# EAGLE design connect4V1 (EAGLE 9.7.0)
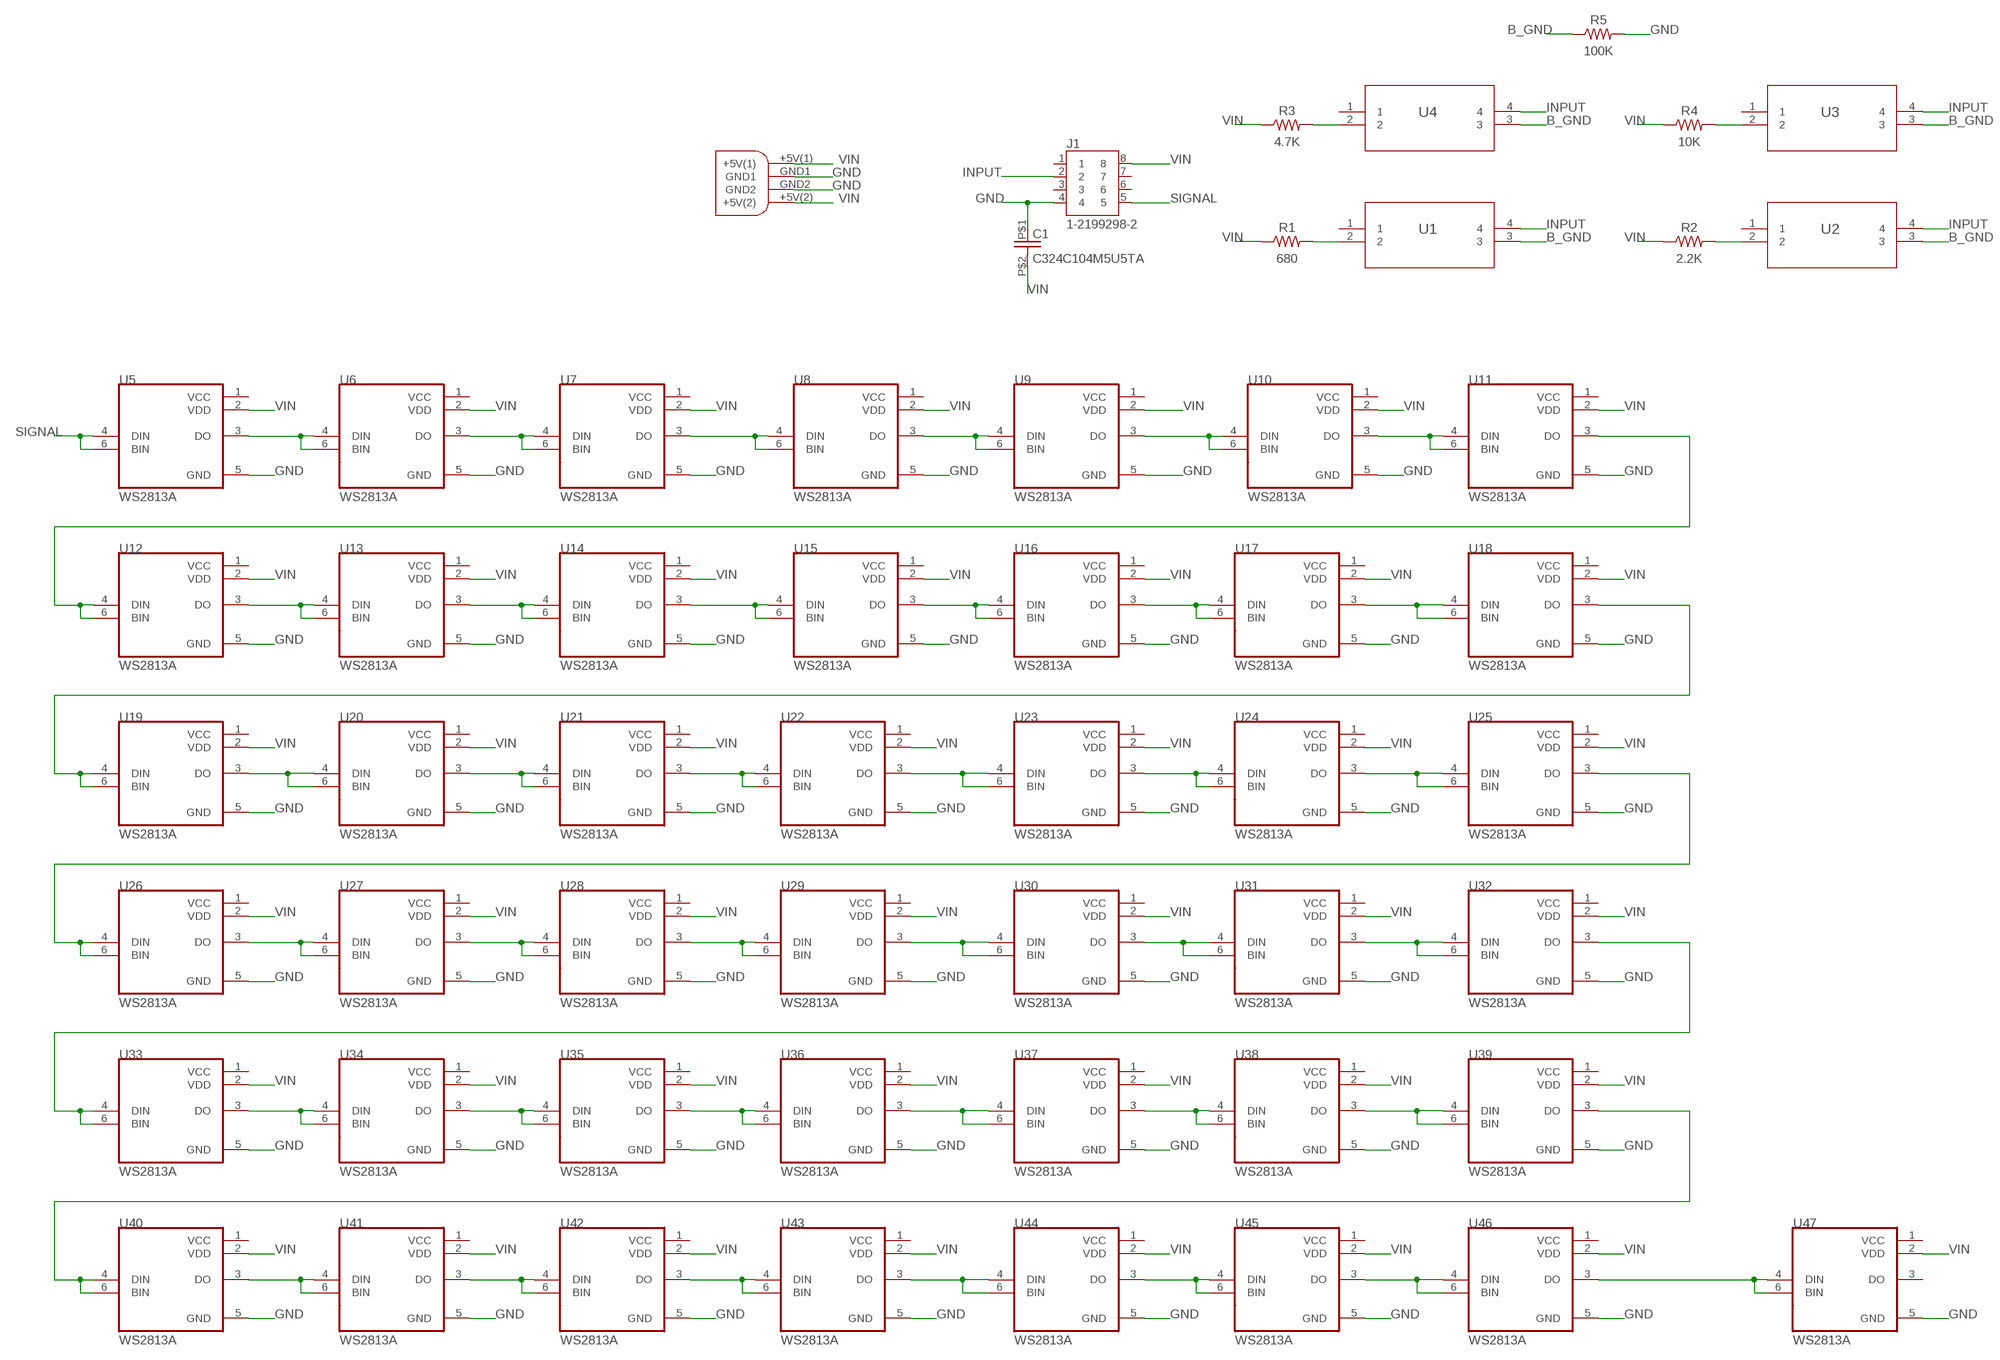
[diagram p0: schematic, sheet 1]

## Parts
C1  C324C104M5U5TA  [CAPRR254W55L508T318H508P]
J1  1-2199298-2  [TE_1-2199298-2]
R1  680  R-US_AXIAL-7.2MM-PITCH  [RESAD724W46L381D178B]
R2  2.2K  R-US_AXIAL-7.2MM-PITCH  [RESAD724W46L381D178B]
R3  4.7K  R-US_AXIAL-7.2MM-PITCH  [RESAD724W46L381D178B]
R4  10K  R-US_AXIAL-7.2MM-PITCH  [RESAD724W46L381D178B]
R5  100K  R-US_AXIAL-7.2MM-PITCH  [RESAD724W46L381D178B]
U1  PTS526_SK15_SMTR2_LFSSMT_FS-M  [SMT_FS-M]
U2  PTS526_SK15_SMTR2_LFSSMT_FS-M  [SMT_FS-M]
U3  PTS526_SK15_SMTR2_LFSSMT_FS-M  [SMT_FS-M]
U4  PTS526_SK15_SMTR2_LFSSMT_FS-M  [SMT_FS-M]
U5  WS2813A  [LED_WS2813A]
U6  WS2813A  [LED_WS2813A]
U7  WS2813A  [LED_WS2813A]
U8  WS2813A  [LED_WS2813A]
U9  WS2813A  [LED_WS2813A]
U10  WS2813A  [LED_WS2813A]
U11  WS2813A  [LED_WS2813A]
U12  WS2813A  [LED_WS2813A]
U13  WS2813A  [LED_WS2813A]
U14  WS2813A  [LED_WS2813A]
U15  WS2813A  [LED_WS2813A]
U16  WS2813A  [LED_WS2813A]
U17  WS2813A  [LED_WS2813A]
U18  WS2813A  [LED_WS2813A]
U19  WS2813A  [LED_WS2813A]
U20  WS2813A  [LED_WS2813A]
U21  WS2813A  [LED_WS2813A]
U22  WS2813A  [LED_WS2813A]
U23  WS2813A  [LED_WS2813A]
U24  WS2813A  [LED_WS2813A]
U25  WS2813A  [LED_WS2813A]
U26  WS2813A  [LED_WS2813A]
U27  WS2813A  [LED_WS2813A]
U28  WS2813A  [LED_WS2813A]
U29  WS2813A  [LED_WS2813A]
U30  WS2813A  [LED_WS2813A]
U31  WS2813A  [LED_WS2813A]
U32  WS2813A  [LED_WS2813A]
U33  WS2813A  [LED_WS2813A]
U34  WS2813A  [LED_WS2813A]
U35  WS2813A  [LED_WS2813A]
U36  WS2813A  [LED_WS2813A]
U37  WS2813A  [LED_WS2813A]
U38  WS2813A  [LED_WS2813A]
U39  WS2813A  [LED_WS2813A]
U40  WS2813A  [LED_WS2813A]
U41  WS2813A  [LED_WS2813A]
U42  WS2813A  [LED_WS2813A]
U43  WS2813A  [LED_WS2813A]
U44  WS2813A  [LED_WS2813A]
U45  WS2813A  [LED_WS2813A]
U46  WS2813A  [LED_WS2813A]
U47  WS2813A  [LED_WS2813A]
U$1  4PIN_POWER  [4PIN_POWER]

## Nets
B_GND: R5.1 U1.3 U2.3 U3.3 U4.3
GND: C1.P$1 J1.4 R5.2 U5.5(GND) U6.5(GND) U7.5(GND) U8.5(GND) U9.5(GND) U10.5(GND) U11.5(GND) U12.5(GND) U13.5(GND) U14.5(GND) U15.5(GND) U16.5(GND) U17.5(GND) U18.5(GND) U19.5(GND) U20.5(GND) U21.5(GND) U22.5(GND) U23.5(GND) U24.5(GND) U25.5(GND) U26.5(GND) U27.5(GND) U28.5(GND) U29.5(GND) U30.5(GND) U31.5(GND) U32.5(GND) U33.5(GND) U34.5(GND) U35.5(GND) U36.5(GND) U37.5(GND) U38.5(GND) U39.5(GND) U40.5(GND) U41.5(GND) U42.5(GND) U43.5(GND) U44.5(GND) U45.5(GND) U46.5(GND) U47.5(GND) U$1.GND1 U$1.GND2
INPUT: J1.2 U1.4 U2.4 U3.4 U4.4
N$1: U6.3(DO) U7.4(DIN) U7.6(BIN)
N$2: U5.3(DO) U6.4(DIN) U6.6(BIN)
N$3: U7.3(DO) U8.4(DIN) U8.6(BIN)
N$4: U8.3(DO) U9.4(DIN) U9.6(BIN)
N$5: U10.3(DO) U11.4(DIN) U11.6(BIN)
N$6: U13.3(DO) U14.4(DIN) U14.6(BIN)
N$7: U30.3(DO) U31.4(DIN) U31.6(BIN)
N$8: U12.3(DO) U13.4(DIN) U13.6(BIN)
N$9: U14.3(DO) U15.4(DIN) U15.6(BIN)
N$10: U15.3(DO) U16.4(DIN) U16.6(BIN)
N$11: U16.3(DO) U17.4(DIN) U17.6(BIN)
N$12: U17.3(DO) U18.4(DIN) U18.6(BIN)
N$13: U19.3(DO) U20.4(DIN) U20.6(BIN)
N$14: U20.3(DO) U21.4(DIN) U21.6(BIN)
N$15: U21.3(DO) U22.4(DIN) U22.6(BIN)
N$16: U22.3(DO) U23.4(DIN) U23.6(BIN)
N$17: U23.3(DO) U24.4(DIN) U24.6(BIN)
N$18: U24.3(DO) U25.4(DIN) U25.6(BIN)
N$19: U18.3(DO) U19.4(DIN) U19.6(BIN)
N$20: U26.3(DO) U27.4(DIN) U27.6(BIN)
N$21: U27.3(DO) U28.4(DIN) U28.6(BIN)
N$22: U28.3(DO) U29.4(DIN) U29.6(BIN)
N$23: U29.3(DO) U30.4(DIN) U30.6(BIN)
N$24: U4.1
N$25: U31.3(DO) U32.4(DIN) U32.6(BIN)
N$26: U25.3(DO) U26.4(DIN) U26.6(BIN)
N$27: U33.3(DO) U34.4(DIN) U34.6(BIN)
N$28: U34.3(DO) U35.4(DIN) U35.6(BIN)
N$29: U35.3(DO) U36.4(DIN) U36.6(BIN)
N$30: U36.3(DO) U37.4(DIN) U37.6(BIN)
N$31: U37.3(DO) U38.4(DIN) U38.6(BIN)
N$32: U38.3(DO) U39.4(DIN) U39.6(BIN)
N$33: U32.3(DO) U33.4(DIN) U33.6(BIN)
N$34: U40.3(DO) U41.4(DIN) U41.6(BIN)
N$35: U41.3(DO) U42.4(DIN) U42.6(BIN)
N$36: U42.3(DO) U43.4(DIN) U43.6(BIN)
N$37: U11.3(DO) U12.4(DIN) U12.6(BIN)
N$38: U43.3(DO) U44.4(DIN) U44.6(BIN)
N$39: U44.3(DO) U45.4(DIN) U45.6(BIN)
N$40: U45.3(DO) U46.4(DIN) U46.6(BIN)
N$41: U39.3(DO) U40.4(DIN) U40.6(BIN)
N$42: U46.3(DO) U47.4(DIN) U47.6(BIN)
N$43: R1.2 U1.2
N$44: R3.2 U4.2
N$45: R2.2 U2.2
N$46: R4.2 U3.2
N$47: U9.3(DO) U10.4(DIN) U10.6(BIN)
SIGNAL: J1.5 U5.4(DIN) U5.6(BIN)
VIN: C1.P$2 J1.8 R1.1 R2.1 R3.1 R4.1 U5.2(VDD) U6.2(VDD) U7.2(VDD) U8.2(VDD) U9.2(VDD) U10.2(VDD) U11.2(VDD) U12.2(VDD) U13.2(VDD) U14.2(VDD) U15.2(VDD) U16.2(VDD) U17.2(VDD) U18.2(VDD) U19.2(VDD) U20.2(VDD) U21.2(VDD) U22.2(VDD) U23.2(VDD) U24.2(VDD) U25.2(VDD) U26.2(VDD) U27.2(VDD) U28.2(VDD) U29.2(VDD) U30.2(VDD) U31.2(VDD) U32.2(VDD) U33.2(VDD) U34.2(VDD) U35.2(VDD) U36.2(VDD) U37.2(VDD) U38.2(VDD) U39.2(VDD) U40.2(VDD) U41.2(VDD) U42.2(VDD) U43.2(VDD) U44.2(VDD) U45.2(VDD) U46.2(VDD) U47.2(VDD) U$1.+5V(1) U$1.+5V(2)
Unconnected: J1.1 J1.3 J1.6 J1.7 U1.1 U2.1 U3.1 U47.3(DO)

## Power pins joined to a net without a drawn wire
VIN: U5.1(VCC) U6.1(VCC) U7.1(VCC) U8.1(VCC) U9.1(VCC) U10.1(VCC) U11.1(VCC) U12.1(VCC) U13.1(VCC) U14.1(VCC) U15.1(VCC) U16.1(VCC) U17.1(VCC) U18.1(VCC) U19.1(VCC) U20.1(VCC) U21.1(VCC) U22.1(VCC) U23.1(VCC) U24.1(VCC) U25.1(VCC) U26.1(VCC) U27.1(VCC) U28.1(VCC) U29.1(VCC) U30.1(VCC) U31.1(VCC) U32.1(VCC) U33.1(VCC) U34.1(VCC) U35.1(VCC) U36.1(VCC) U37.1(VCC) U38.1(VCC) U39.1(VCC) U40.1(VCC) U41.1(VCC) U42.1(VCC) U43.1(VCC) U44.1(VCC) U45.1(VCC) U46.1(VCC) U47.1(VCC)

## Library data of the parts
C1 = ceramicCap:C324C104M5U5TA: Cap Ceramic 0.1uF 50V Z5U 20% Radial 2.54mm 85C Bulk; MANUFACTURER: Kemet
J1 = 8PinDip:1-2199298-2: CONN IC DIP SOCKET 8POS TIN; COMMENT: 1-2199298-2
R1-R5 = Resistor:R-US: Resistor Fixed - ANSI; CATEGORY: Resistor; SUB-CATEGORY: Fixed
U1-U4 = SMD_Button:PTS526_SK15_SMTR2_LFS; BUILT_BY: EMA_Matt; COPYRIGHT: Copyright (C) 2018 Accelerated Designs. All rights reserved; MANUFACTURER_PART_NUMBER: PTS526 SK15 SMTR2 LFS; SOURCELIBRARY: C&K_2019-11-15; VENDOR: C&K
U5-U47 = WS2813A:WS2813A: Intelligent control LED integrated light source; MANUFACTURER: Worldsemi; STANDARD: Manufacturer Recommendations
U$1 = 4Pin_power_connector:4PIN_POWER

## Board
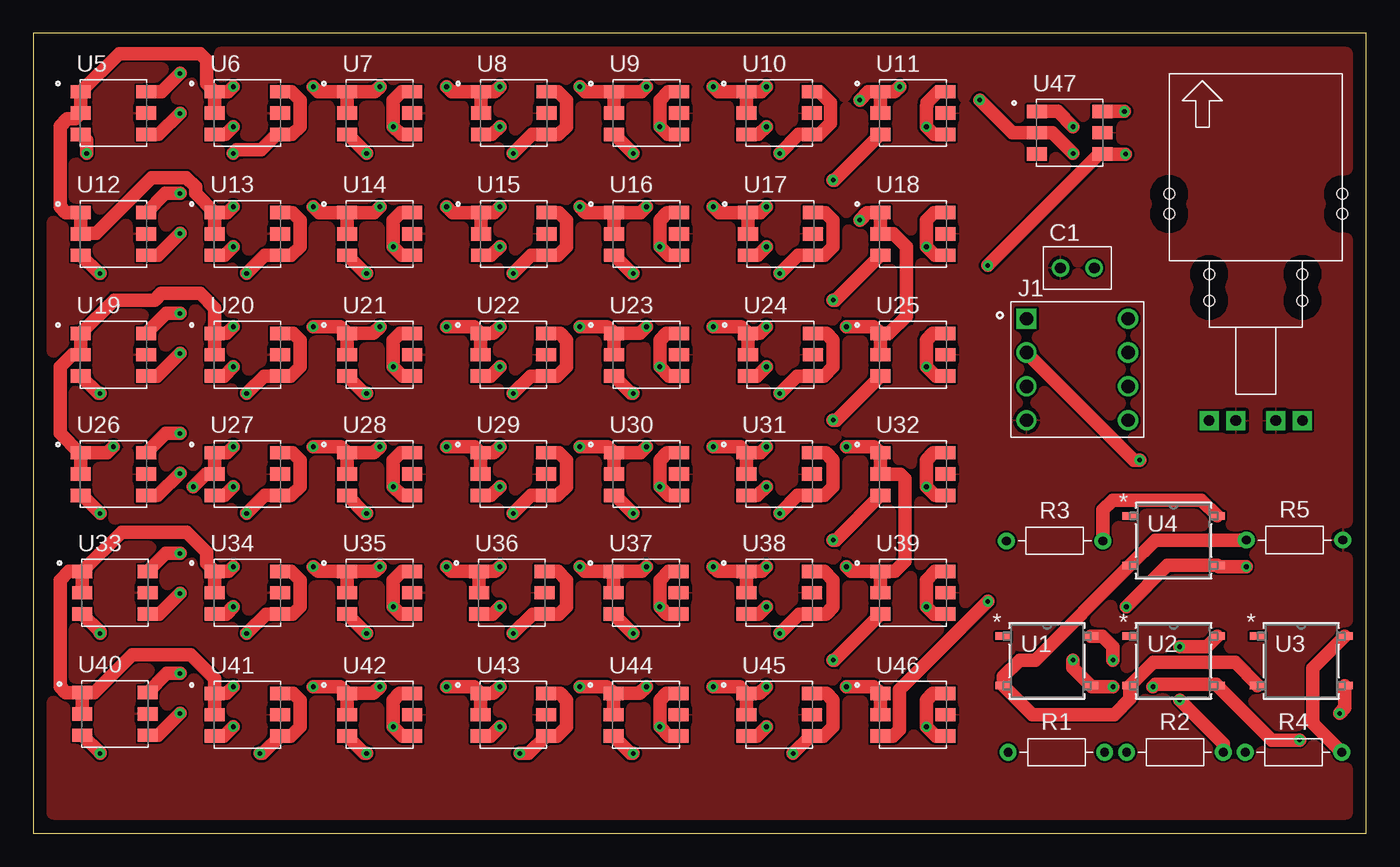
[diagram p1: board, top side]
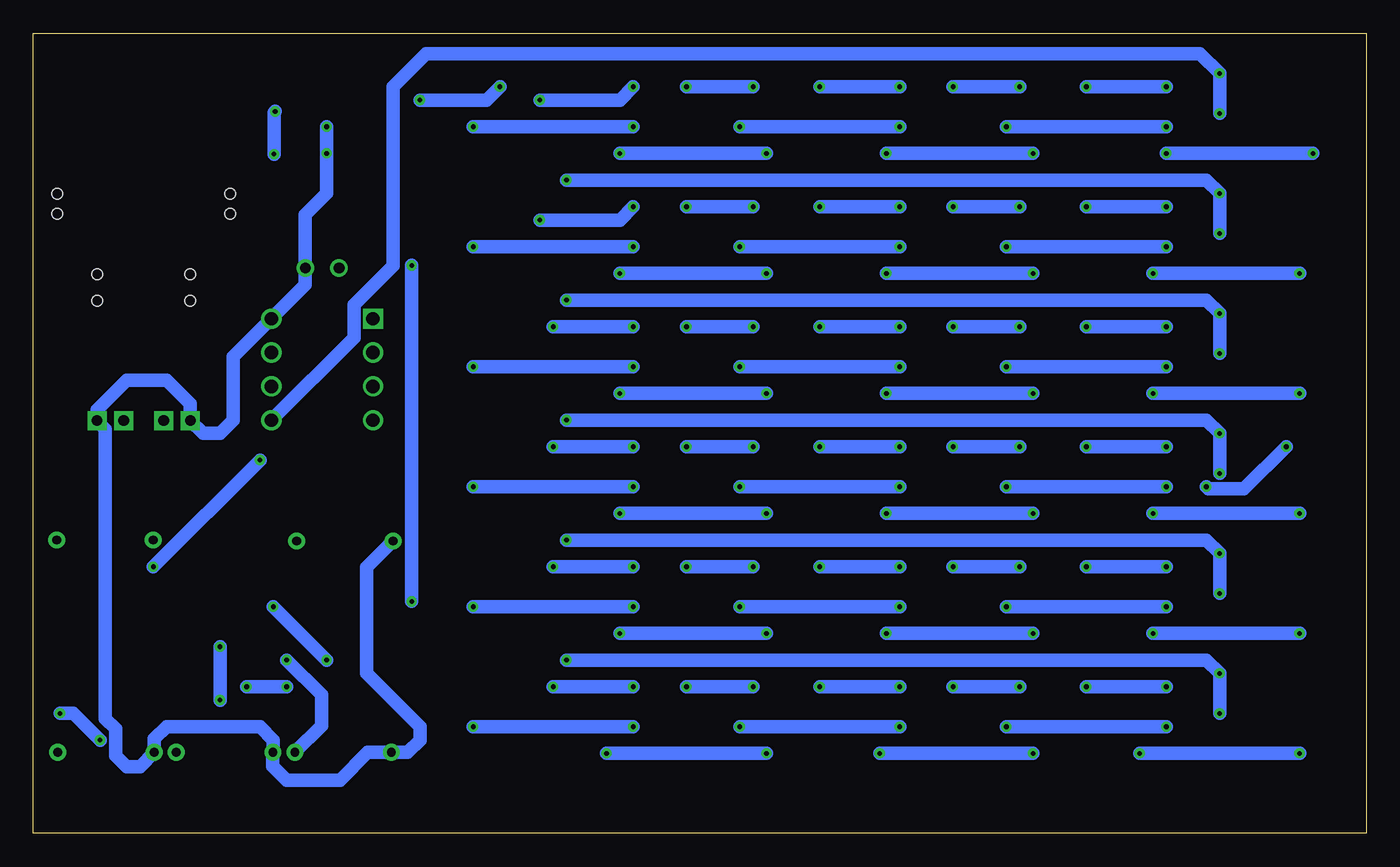
[diagram p2: board, bottom side, seen from below]

Size 100 x 60 mm. Coordinates in mm from the lower left corner, seen from the top.
Outline: 0,0 100,0 100,60 0,60 0,0
Copper layers (1*16): Top 0.035mm / dielectric 1.5mm / Bottom 0.035mm
Design rules "default": minimum track width 6mil, minimum drill 0.35mm, track to track 6mil, track to pad 6mil, pad to pad 6mil, via to via 6mil, smd to smd 6mil, copper to edge 40mil, drill to drill 6mil, minimum pad ring 10mil, minimum via ring 8mil, stop-mask expansion 4mil, vias tented up to drill 0mil, thermal gap 10mil

### Footprints (pad centres in the part's own frame; a part is rotated, then mirrored left to right if it is on the bottom)
CAPRR254W55L508T318H508P = drill 0.8: P$1 -1.27,0; P$2 1.27,0
TE_1-2199298-2 = drill 1 square: 1 -3.81,3.81 | drill 1: 2 -3.81,1.27; 3 -3.81,-1.27; 4 -3.81,-3.81; 5 3.81,-3.81; 6 3.81,-1.27; 7 3.81,1.27; 8 3.81,3.81
RESAD724W46L381D178B = drill 0.66 pad 1.26: 1 -3.62,0; 2 3.62,0
SMT_FS-M = smd 1.156 x 0.559: 1 -3.283,1.854; 2 3.283,1.854; 3 -3.283,-1.854; 4 3.283,-1.854
LED_WS2813A = smd 1.5 x 1: 1 -2.45,1.6; 2 -2.45,0; 3 -2.45,-1.6; 4 2.45,-1.6; 5 2.45,0; 6 2.45,1.6
4PIN_POWER = drill 0.8 pad 1.422 square: +5V(1) 3,-12; +5V(2) 10,-12; GND1 5,-12; GND2 8,-12 | hole 0.8: 13,5; 0,5; 10,-1; 10,-3; 3,-3; 3,-1; 13,3.5; 0,3.5

### Placement (x,y rotation side)
C1  78.33,42.41 0 top
J1  78.33,34.79 0 top
R1  76.76,6.08 0 top
R2  85.65,6.08 0 top
R3  76.63,21.93 0 top
R4  94.54,6.08 0 top
R5  94.63,22 0 top
U1  76.06,12.93 0 top
U2  85.55,12.93 0 top
U3  95.12,12.93 0 top
U4  85.55,21.95 0 top
U5  6.02,54.02 0 top
U6  16.05,54.02 0 top
U7  25.98,54.02 0 top
U8  36.04,54.02 0 top
U9  46,54.02 0 top
U10  55.96,54.02 0 top
U11  65.99,54.02 0 top
U12  6.02,44.96 0 top
U13  16.05,44.96 0 top
U14  25.98,44.96 0 top
U15  36.04,44.96 0 top
U16  46,44.96 0 top
U17  56.06,44.96 0 top
U18  65.99,44.96 0 top
U19  6.02,35.9 0 top
U20  16.05,35.9 0 top
U21  25.98,35.9 0 top
U22  36.01,35.9 0 top
U23  46,35.9 0 top
U24  56.06,35.9 0 top
U25  65.99,35.9 0 top
U26  6.02,26.94 0 top
U27  16.05,26.94 0 top
U28  25.98,26.94 0 top
U29  36.01,26.94 0 top
U30  46,26.94 0 top
U31  55.96,26.94 0 top
U32  65.99,26.94 0 top
U33  6.12,18.05 0 top
U34  16.05,18.05 0 top
U35  25.98,18.05 0 top
U36  35.91,18.05 0 top
U37  45.97,18.05 0 top
U38  55.96,18.05 0 top
U39  65.99,18.05 0 top
U40  6.12,8.96 0 top
U41  16.05,8.89 0 top
U42  25.98,8.89 0 top
U43  36.01,8.89 0 top
U44  45.97,8.89 0 top
U45  55.96,8.89 0 top
U46  65.99,8.89 0 top
U47  77.76,52.54 0 top
U$1  85.22,42.95 0 top

### Tracks (layer width: path | path; a pad name or v marks a point on that pad's centre or on a via)
B_GND
  Top 1.016: R5.1 84.17,22 U4.3 75.17,13 74,13 72.78,11.78 U1.3 74.94,8.91 81.1,8.91 82.27,10.08 U2.3 84.02,12.83 90.17,12.83 91.84,11.16 U3.3
GND
  pour Top: -2,65 102,65 105,62 105,-2 101,-6 -1,-6 -4,-3 -4,63
INPUT  (via drill 0.35)
  Top 1.016: J1.2 82.58,28 v83,28 | v78,13 78,12.42 U1.4 79.42,11 v81,11 | v95,7 92.91,7 U2.4 88.74,11.17 84.17,11.17 v84,11 | v98,9 98.41,9.41 U3.4 | v91,20 88.93,20 U4.4 85.1,20.1 v82,17
  Bottom 1.016: v81,11 v84,11 | v98,9 97,9 v95,7 | v83,28 v91,20 | v82,17 v78,13
N$1  (via drill 0.35)
  Top 1.016: U6.3 14.42,52.42 v15,53 | U7.4 27.58,52.42 v27,53 27,55 27.62,55.62 U7.6
  Bottom 1.016: v15,53 v27,53
N$2  (via drill 0.35)
  Top 1.016: U6.6 19.38,55.62 20,55 20,53 19.42,52.42 U6.4 18.25,52.42 17.08,51.25 15.25,51.25 v15,51 | U5.3 4,51.99 v4,51
  Bottom 1.016: v4,51 v15,51
N$3  (via drill 0.35)
  Top 1.016: U8.6 39.38,55.62 40,55 40,53 39.42,52.42 U8.4 37.42,52.42 v36,51 | U7.3 23.58,52.42 v25,51
  Bottom 1.016: v25,51 v36,51
N$4  (via drill 0.35)
  Top 1.016: U8.3 34.42,52.42 v35,53 | U9.4 47.58,52.42 v47,53 47,55 47.62,55.62 U9.6
  Bottom 1.016: v35,53 v47,53
N$5  (via drill 0.35)
  Top 1.016: U10.3 54.42,52.42 v55,53 | U11.4 67.58,52.42 v67,53 67,54.53 67.03,54.56 67.03,54.79 67.86,55.62 U11.6
  Bottom 1.016: v55,53 v67,53
N$6  (via drill 0.35)
  Top 1.016: U13.3 14.36,43.36 v15,44 | U14.6 27.56,46.56 27,46 v27,44 27.64,43.36 U14.4
  Bottom 1.016: v15,44 v27,44
N$7  (via drill 0.35)
  Top 1.016: U31.6 59.46,28.54 60,28 60,26 59.34,25.34 U31.4 57.34,25.34 v56,24 | U30.3 43.66,25.34 v45,24
  Bottom 1.016: v45,24 v56,24
N$8  (via drill 0.35)
  Top 1.016: U13.6 19.44,46.56 20,46 20,44 19.36,43.36 U13.4 17.36,43.36 v16,42 | v5,42 4.93,42 U12.3
  Bottom 1.016: v5,42 v16,42
N$9  (via drill 0.35)
  Top 1.016: U15.6 39.44,46.56 40,46 40,44 39.36,43.36 U15.4 37.36,43.36 v36,42 | U14.3 24.89,42 v25,42
  Bottom 1.016: v25,42 v36,42
N$10  (via drill 0.35)
  Top 1.016: U15.3 34.36,43.36 v35,44 | U16.6 47.56,46.56 47,46 v47,44 47.64,43.36 U16.4
  Bottom 1.016: v35,44 v47,44
N$11  (via drill 0.35)
  Top 1.016: U16.3 44.91,42 v45,42 | v56,42 57.36,43.36 U17.4 59.36,43.36 60,44 60,46 59.44,46.56 U17.6
  Bottom 1.016: v45,42 v56,42
N$12  (via drill 0.35)
  Top 1.016: U17.3 54.36,43.36 v55,44 | U18.6 67.56,46.56 67,46 v67,44 67.64,43.36 U18.4
  Bottom 1.016: v55,44 v67,44
N$13  (via drill 0.35)
  Top 1.016: U20.6 19.5,37.5 20,37 20,35 19.3,34.3 U20.4 17.3,34.3 v16,33 | U19.3 4.87,33 v5,33
  Bottom 1.016: v5,33 v16,33
N$14  (via drill 0.35)
  Top 1.016: U21.4 27.7,34.3 v27,35 27,37 27.5,37.5 U21.6 | U20.3 14.3,34.3 v15,35
  Bottom 1.016: v27,35 v15,35
N$15  (via drill 0.35)
  Top 1.016: U22.6 39.5,37.5 40,37 40,35 39.3,34.3 U22.4 37.3,34.3 v36,33 | U21.3 24.83,33 v25,33
  Bottom 1.016: v25,33 v36,33
N$16  (via drill 0.35)
  Top 1.016: U23.6 47.5,37.5 47,37 v47,35 47.7,34.3 U23.4 | U22.3 34.3,34.3 v35,35
  Bottom 1.016: v47,35 v35,35
N$17  (via drill 0.35)
  Top 1.016: U24.6 59.5,37.5 60,37 60,35 59.3,34.3 U24.4 57.3,34.3 v56,33 | U23.3 44.85,33 v45,33
  Bottom 1.016: v45,33 v56,33
N$18  (via drill 0.35)
  Top 1.016: U25.6 67.5,37.5 67,37 v67,35 67.7,34.3 U25.4 | U24.3 54.3,34.3 v55,35
  Bottom 1.016: v67,35 v55,35
N$19  (via drill 0.35)
  Top 1.016: U18.3 60.18,40 v60,40 | U19.6 9.97,39 v11,39 | U19.4 9.3,34.3 v11,36
  Bottom 1.016: v60,40 12,40 v11,39 v11,36
N$20  (via drill 0.35)
  Top 1.016: U27.6 19.46,28.54 20,28 20,26 19.34,25.34 U27.4 17.34,25.34 v16,24 | U26.3 3.66,25.34 v5,24
  Bottom 1.016: v5,24 v16,24
N$21  (via drill 0.35)
  Top 1.016: U27.3 14.34,25.34 v15,26 | U28.4 27.66,25.34 v27,26 27,28 27.54,28.54 U28.6
  Bottom 1.016: v15,26 v27,26
N$22  (via drill 0.35)
  Top 1.016: U29.6 39.46,28.54 40,28 40,26 39.34,25.34 U29.4 37.34,25.34 v36,24 | U28.3 24.87,24 v25,24
  Bottom 1.016: v25,24 v36,24
N$23  (via drill 0.35)
  Top 1.016: U30.4 47.66,25.34 v47,26 47,28 47.54,28.54 U30.6 | U29.3 34.34,25.34 v35,26
  Bottom 1.016: v35,26 v47,26
N$25  (via drill 0.35)
  Top 1.016: U32.6 67.54,28.54 67,28 v67,26 67.66,25.34 U32.4 | U31.3 54.34,25.34 v55,26
  Bottom 1.016: v55,26 v67,26
N$26  (via drill 0.35)
  Top 1.016: U25.3 60.24,31 v60,31 | U26.6 9.93,30 v11,30 | U26.4 9.34,25.34 v11,27
  Bottom 1.016: v60,31 12,31 v11,30 v11,27
N$27  (via drill 0.35)
  Top 1.016: U34.6 19.35,19.65 20,19 20,17 19.45,16.45 U34.4 17.45,16.45 v16,15 | U33.3 5,15.12 v5,15
  Bottom 1.016: v5,15 v16,15
N$28  (via drill 0.35)
  Top 1.016: U34.3 14.45,16.45 v15,17 | U35.4 27.55,16.45 v27,17 27,19 27.65,19.65 U35.6
  Bottom 1.016: v15,17 v27,17
N$29  (via drill 0.35)
  Top 1.016: U36.6 39.35,19.65 40,19 40,17 39.45,16.45 U36.4 37.45,16.45 v36,15 | U35.3 24.98,15 v25,15
  Bottom 1.016: v25,15 v36,15
N$30  (via drill 0.35)
  Top 1.016: U36.3 34.45,16.45 v35,17 | U37.4 47.55,16.45 v47,17 47,19 47.65,19.65 U37.6
  Bottom 1.016: v35,17 v47,17
N$31  (via drill 0.35)
  Top 1.016: U38.6 59.35,19.65 60,19 60,17 59.45,16.45 U38.4 57.45,16.45 v56,15 | U37.3 44.97,15 v45,15
  Bottom 1.016: v45,15 v56,15
N$32  (via drill 0.35)
  Top 1.016: U39.4 67.55,16.45 v67,17 67,19 67.65,19.65 U39.6 | U38.3 54.45,16.45 v55,17
  Bottom 1.016: v55,17 v67,17
N$33  (via drill 0.35)
  Top 1.016: U32.3 60.2,22 v60,22 | U33.6 9.92,21 v11,21 | U33.4 9.45,16.45 v11,18
  Bottom 1.016: v60,22 12,22 v11,21 v11,18
N$34  (via drill 0.35)
  Top 1.016: U41.6 19.51,10.49 20,10 20,8 19.29,7.29 U41.4 17.21,6 v17,6 | U40.3 5,6.03 v5,6
  Bottom 1.016: v5,6 v17,6
N$35  (via drill 0.35)
  Top 1.016: U42.4 27.71,7.29 v27,8 27,10 27.49,10.49 U42.6 | U41.3 14.29,7.29 v15,8
  Bottom 1.016: v27,8 v15,8
N$36  (via drill 0.35)
  Top 1.016: U43.6 39.51,10.49 40,10 40,8 39.29,7.29 U43.4 37.17,6 v36.5,6 | U42.3 24.82,6 v25,6
  Bottom 1.016: v25,6 v36.5,6
N$37  (via drill 0.35)
  Top 1.016: U11.3 60.12,49 v60,49 | U12.6 9.91,48 v11,48 | U12.4 9.36,43.36 v11,45
  Bottom 1.016: v60,49 12,49 v11,48 v11,45
N$38  (via drill 0.35)
  Top 1.016: U44.4 47.71,7.29 v47,8 47,10 47.49,10.49 U44.6 | U43.3 34.29,7.29 v35,8
  Bottom 1.016: v47,8 v35,8
N$39  (via drill 0.35)
  Top 1.016: U45.6 59.51,10.49 60,10 60,8 59.29,7.29 U45.4 58.29,7.29 v57,6 | U44.3 44.81,6 v45,6
  Bottom 1.016: v45,6 v57,6
N$40  (via drill 0.35)
  Top 1.016: U46.4 67.71,7.29 v67,8 67,10 67.49,10.49 U46.6 | U45.3 54.29,7.29 v55,8
  Bottom 1.016: v67,8 v55,8
N$41  (via drill 0.35)
  Top 1.016: U39.3 60.09,13 v60,13 | U40.6 10.01,12 v11,12 | U40.4 9.36,7.36 v11,9
  Bottom 1.016: v60,13 12,13 v11,12 v11,9
N$42  (via drill 0.35)
  Top 1.016: v71.61,42.59 79.96,50.94 U47.4 v81.94,50.94 | v71.61,17.39 64.99,10.77 64.99,7.77 64.51,7.29 U46.3 | U47.6 v81.86,54.14
  Bottom 1.016: v71.61,17.39 v71.61,42.59 | v81.86,54.14 81.94,54.06 v81.94,50.94
N$43  (via drill 0.35)
  Top 1.016: v81,13 81,14 80.22,14.78 U1.2
  Bottom 1.016: R1.2 78.38,8.08 78.38,10.38 v81,13
N$44
  Top 1.016: R3.2 80.25,24.25 81,25 87.64,25 U4.2
N$45  (via drill 0.35)
  Top 1.016: R2.2 89.27,6.73 v86,10 | U2.2 88.05,14 v86,14
  Bottom 1.016: v86,10 v86,14
N$46
  Top 1.016: U3.2 96,12.38 96,8.24 R4.2
N$47  (via drill 0.35)
  Top 1.016: U10.6 58.99,55.62 59.82,54.79 59.82,53.25 58.99,52.42 U10.4 57.42,52.42 v56,51 | U9.3 43.58,52.42 v45,51
  Bottom 1.016: v45,51 v56,51
SIGNAL  (via drill 0.35)
  Top 1.016: U5.4 9.42,52.42 v11,54 | v11,57 9.62,55.62 U5.6
  Bottom 1.016: J1.5 75.93,37.19 75.93,39.63 73,42.56 73,56 70.52,58.48 12.48,58.48 v11,57 v11,54
VIN  (via drill 0.35)
  Top 1.016: v78,51 76.46,52.54 U47.2 73.46,52.54 v71,55 | v78,53 76.86,54.14 U47.1 | v65,56 64.62,55.62 U11.1 | v55,56 54.62,55.62 U10.1 | U11.2 U11.1 | U11.1 62.62,55.62 v62,55 | U10.1 U10.2 | U9.1 U9.2 | U16.1 U16.2 | U17.1 U17.2 | U25.1 U25.2 | U24.1 U24.2 | U23.1 U23.2 | U22.1 U22.2 | U21.1 U21.2 | U20.1 U20.2 | U13.1 U13.2 | U26.1 U26.2 | U28.1 U28.2 | U35.1 U35.2 | U34.1 U34.2 | U33.1 U33.2 | U40.1 U40.2 | U41.1 U41.2 | U42.1 U42.2 | U43.1 U43.2 | U44.1 U44.2 | U45.1 U45.2 | U46.2 U46.1 63.03,11 v61,11 | U39.1 U39.2 | U31.1 U31.2 | U38.1 U38.2 | U37.1 U37.2 | U30.1 U30.2 | U29.1 U29.2 | U36.1 U36.2 | U6.1 U6.2 | U7.1 U7.2 | U14.1 U14.2 | U15.1 U15.2 | U8.1 U8.2 | U10.1 51.38,55.62 v51,56 | v46,56 45.62,55.62 U9.1 | U9.1 41.38,55.62 v41,56 | v35,56 34.62,55.62 U8.1 | U8.1 31.38,55.62 v31,56 | v26,56 25.62,55.62 U7.1 | U7.1 21.38,55.62 v21,56 | U6.1 13,56.22 13,58 12.52,58.48 6.43,58.48 U5.1 U5.2 3.14,53.59 2.55,53.59 2,53.03 2,47 2.44,46.56 U12.1 U12.2 3.61,45 4.73,45 8.89,49.17 11.48,49.17 12.17,48.48 12.17,47.99 U13.1 | v62,46 62.56,46.56 U18.1 U18.2 64.54,44.96 65.5,44 65.5,38.8 64.2,37.5 U25.1 | v55,47 54.56,46.56 U17.1 | U17.1 51.44,46.56 v51,47 | v46,47 45.56,46.56 U16.1 | U16.1 41.44,46.56 v41,47 | v35,47 34.56,46.56 U15.1 | U15.1 31.44,46.56 v31,47 | v26,47 25.56,46.56 U14.1 | U14.1 21.44,46.56 v21,47 | U20.1 13.6,39.4 12.5,40.5 9.6,40.5 9.1,40 6.07,40 U19.1 U19.2 2.9,35.9 2,35 2,30 3.46,28.54 U26.1 | U20.1 14.5,37.5 v15,38 | v21,38 23.03,38 U21.1 | U21.1 25.5,37.5 v26,38 | v31,38 33.06,38 U22.1 | v41,38 43.05,38 U23.1 | U23.1 45.5,37.5 v46,38 | v51,38 53.11,38 U24.1 | v61,38 63.04,38 U25.1 | U26.1 5.54,28.54 v6,29 | v12,26 12.94,26.94 U27.2 U27.1 14.54,28.54 v15,29 | v21,29 23.07,29 U28.1
  Top 1.016: U28.1 25.54,28.54 v26,29 | v31,29 33.1,29 U29.1 | v41,29 43.09,29 U30.1 | U30.1 45.54,28.54 v46,29 | v51,29 53.05,29 U31.1 | v61,29 63.08,29 U32.1 U32.2 65.06,26.94 65.4,26.6 65.4,20.4 64.65,19.65 U39.1 | U31.1 54.54,28.54 v55,29 | U39.1 61.35,19.65 v61,20 | v55,20 54.65,19.65 U38.1 | U38.1 51.35,19.65 v51,20 | v46,20 45.65,19.65 U37.1 | U37.1 41.35,19.65 v41,20 | v35,20 34.65,19.65 U36.1 | v35,29 34.54,28.54 U29.1 | v35,38 34.5,37.5 U22.1 | v15,56 14.62,55.62 U6.1 | v15,47 14.56,46.56 U13.1 | v55,38 54.5,37.5 U24.1 | U36.1 31.35,19.65 v31,20 | v26,20 25.65,19.65 U35.1 | U35.1 21.35,19.65 v21,20 | v15,20 14.65,19.65 U34.1 | U34.1 13,20.25 13,21.1 11.5,22.6 6.62,22.6 U33.1 | U33.1 2.65,19.65 2,19 2,11 2.44,10.56 U40.1 | U40.1 4.56,10.56 7.4,13.4 11.8,13.4 13.6,11.6 U41.1 | U41.1 14.49,10.49 v15,11 | v21,11 23.02,11 U42.1 | U42.1 25.49,10.49 v26,11 | v31,11 33.05,11 U43.1 | U43.1 34.49,10.49 v35,11 | v41,11 43.01,11 U44.1 | U44.1 45.49,10.49 v46,11 | v51,11 53,11 U45.1 | U45.1 54.49,10.49 v55,11
  Bottom 1.016: v78,53 v78,51 78,48 79.6,46.4 C1.P$2 79.6,41.14 J1.8 85,35.74 85,31 86,30 87.27,30 U$1.+5V(1) 88.22,32.22 90,34 93,34 95.22,31.78 U$1.+5V(2) 94.59,30.32 94.59,8.59 93.83,7.83 93.83,5.83 93,5 92,5 R4.1 90.92,7.08 90,8 83,8 82,7 82,6.11 R2.1 82.03,5.03 81,4 77,4 74.92,6.08 R1.1 71.92,6.08 71,7 71,8 75,12 75,19.94 R3.1 | v71,55 65.99,55 v65,55.99 v65,56 | v62,55 56,55 v55,56 | v51,56 v46,56 | v41,56 v35,56 | v31,56 v26,56 | v62,46 56,46 v55,47 | v51,47 v46,47 | v41,47 v35,47 | v31,47 v26,47 | v15,38 v21,38 | v26,38 v31,38 | v46,38 v51,38 | v15,29 v21,29 | v26,29 v31,29 | v46,29 v51,29 | v55,29 v61,29 | v61,20 v55,20 | v51,20 v46,20 | v41,20 v35,20 | v41,29 v35,29 | v41,38 v35,38 | v21,56 v15,56 | v21,47 v15,47 | v61,38 v55,38 | v31,20 v26,20 | v21,20 v15,20 | v15,11 v21,11 | v26,11 v31,11 | v35,11 v41,11 | v46,11 v51,11 | v55,11 v61,11 | v6,29 9.17,25.83 11.83,25.83 v12,26